# EAGLE design USB_Audio_Front_1 (EAGLE 9.6.2)
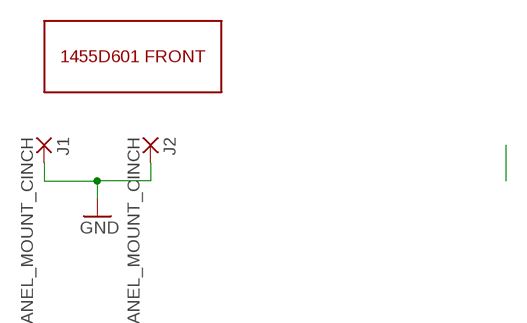
[diagram p0: schematic, sheet 1]

## Parts
J1  PANEL_MOUNT_CINCH  [CINCH_6.5MM]
J2  PANEL_MOUNT_CINCH  [CINCH_6.5MM]
U$1  HM_1455D601_FRONT  [HM_1455D601_FRONT]

## Nets
GND: J1.P$1(P) J2.P$1(P)

## Library data of the parts
J1 J2 = Rietig_Mechanik:PANEL_MOUNT_CINCH
U$1 = Rietig_Mechanik:HM_1455D601_FRONT

## Board
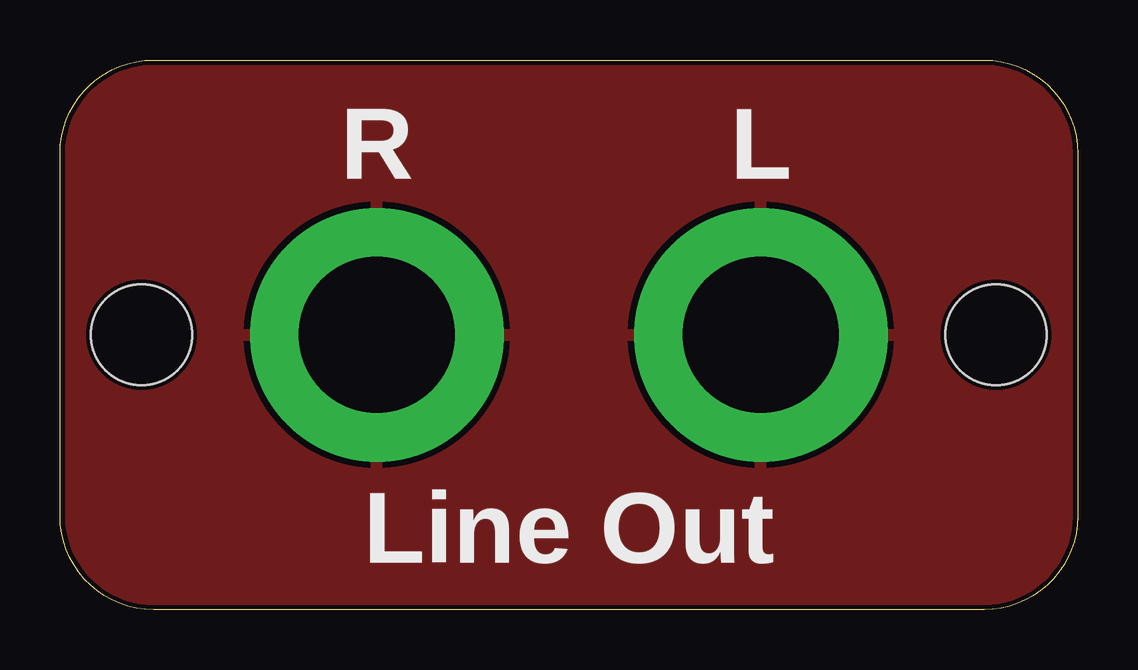
[diagram p1: board, top side]
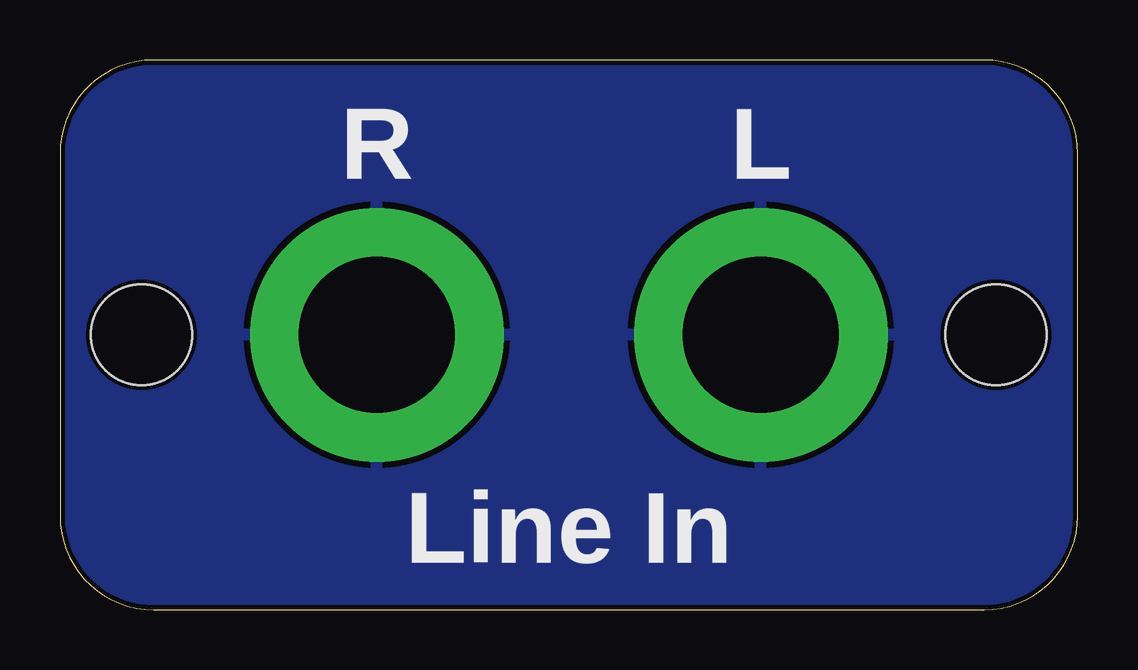
[diagram p2: board, bottom side, seen from below]

Size 42.4 x 22.9 mm. Coordinates in mm from the lower left corner, seen from the top.
Copper layers (1*16): Top 0.035mm / dielectric 1.6mm / Bottom 0.035mm
Design rules "jlcpcb-2layers *": minimum track width 0.2mm, minimum drill 0.3mm, track to track 5mil, track to pad 5mil, pad to pad 5mil, via to via 5mil, smd to smd 5mil, copper to edge 0.2mm, drill to drill 6mil, minimum pad ring 10mil, minimum via ring 0.125mm, stop-mask expansion 4mil, vias tented up to drill 0mil, thermal gap 10mil

### Footprints (pad centres in the part's own frame; a part is rotated, then mirrored left to right if it is on the bottom)
CINCH_6.5MM = drill 6.5 pad 9.5: P$1 0,0
HM_1455D601_FRONT = hole 4.2: -17.8,0; 17.8,0

### Placement (x,y rotation side)
J1  13.2,11.45 0 top
J2  29.2,11.45 0 top
U$1  21.2,11.45 0 top

### Tracks (layer width: path | path; a pad name or v marks a point on that pad's centre or on a via)
GND
  pour Bottom: -0.3,3.85 -0.3,19.05 arc-90 3.6,22.95 38.8,22.95 arc-90 42.7,19.05 42.7,3.85 arc-90 38.8,-0.05 3.6,-0.05 arc-90
  pour Top: -0.3,22.95 42.7,22.95 42.7,-0.05 -0.3,-0.05

### Text on the board
tPlace: R | L | Line Out
bPlace: L | R | Line In